# EasyEDA Pro project pcb文件.epro

# Schematic Schematic1
Board Name: Board1; Create Date: 2024-08-30; Page Name: P1; Project Name: New Project_2024-08-30_11-55-39; Schematic Name: Schematic1; Update Date: 2026-05-20; Add into BOM: yes; Company: 嘉立创EDA; Convert to PCB: yes; Page Size: A4; Version: V1.0
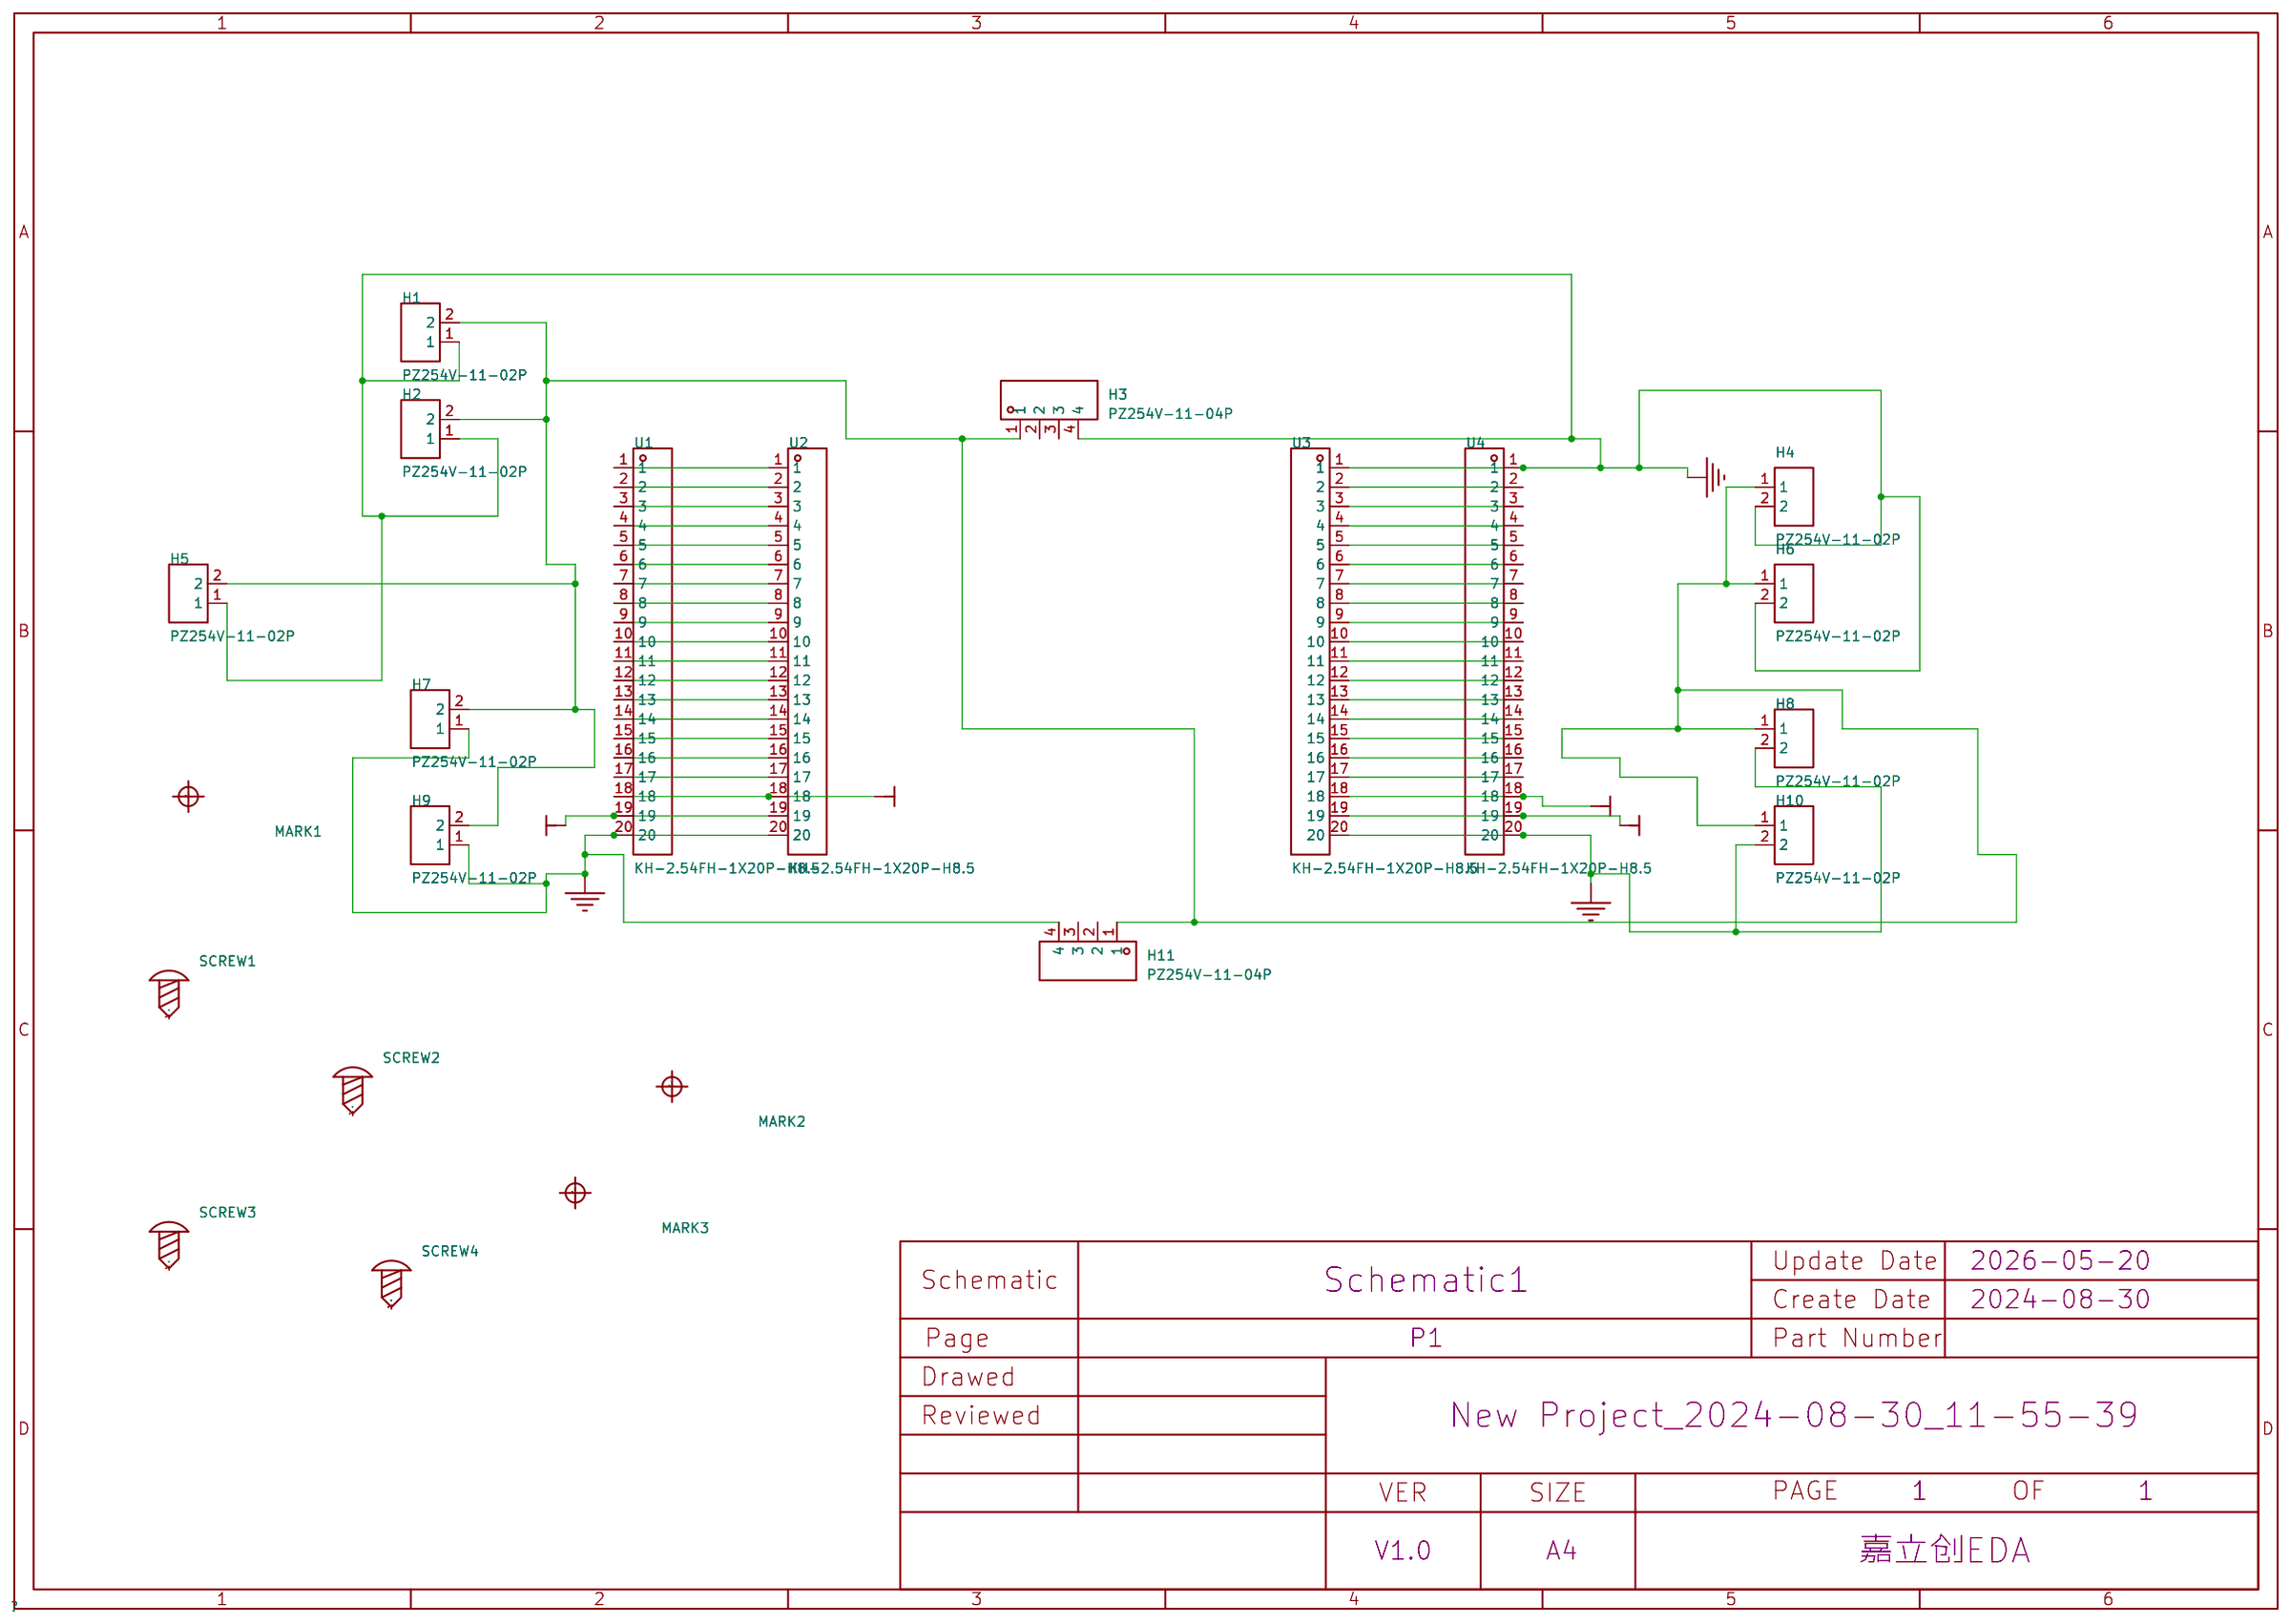
[diagram p0: schematic sheet]

## Parts
H1  PZ254V-11-02P  [HDR-TH_2P-P2.54-V-M]
H2  PZ254V-11-02P  [HDR-TH_2P-P2.54-V-M]
H3  PZ254V-11-04P  [HDR-TH_4P-P2.54-V-M]
H4  PZ254V-11-02P  [HDR-TH_2P-P2.54-V-M]
H5  PZ254V-11-02P  [HDR-TH_2P-P2.54-V-M]
H6  PZ254V-11-02P  [HDR-TH_2P-P2.54-V-M]
H7  PZ254V-11-02P  [HDR-TH_2P-P2.54-V-M]
H8  PZ254V-11-02P  [HDR-TH_2P-P2.54-V-M]
H9  PZ254V-11-02P  [HDR-TH_2P-P2.54-V-M]
H10  PZ254V-11-02P  [HDR-TH_2P-P2.54-V-M]
H11  PZ254V-11-04P  [HDR-TH_4P-P2.54-V-M]
MARK1  -  [Mark-Point-1mm]  (no BOM)
MARK2  -  [Mark-Point-1mm]  (no BOM)
MARK3  -  [Mark-Point-1mm]  (no BOM)
SCREW1  -  [M3螺丝]
SCREW2  -  [M3螺丝]
SCREW3  -  [M3螺丝]
SCREW4  -  [M3螺丝]
U1  KH-2.54FH-1X20P-H8.5  [HDR-TH_20P-P2.54-V-F-2]
U2  KH-2.54FH-1X20P-H8.5  [HDR-TH_20P-P2.54-V-F-2]
U3  KH-2.54FH-1X20P-H8.5  [HDR-TH_20P-P2.54-V-F-2]
U4  KH-2.54FH-1X20P-H8.5  [HDR-TH_20P-P2.54-V-F-2]

## Library data of the parts
H1 H2 H4-H10 = PZ254V-11-02P: 插针结构:1x2P;间距:2.54mm;行距:-;圆针/方针:方针;安装方式:直插;排数:单排;总PIN位数:2P;额定电流:3A;额定电压:250V;配合针长度:6mm;塑高:2.5mm;端接针长度:3mm;触头材质:黄铜;触头镀层:-;工作温度:-40℃~+105℃;颜色:黑色;; LCSC Part Name: 1x2P 间距:2.54mm 方针 直插; Supplier Part: C492401; Manufacturer: XFCN(兴飞); Supplier Footprint: 插件,P=2.54mm; JLCPCB Part Class: Extended Part; Datasheet: https://item.szlcsc.com/datasheet/PZ254V-11-02P/502957.html; Supplier: LCSC; Pin Structure: 1x2P; Pitch: 2.54mm; Circluar Pins/Square Pins: 方针; Mounting Type: 直插; Number of Rows: 单排; Number of Pins: 2P; Current Rating: 3A; Voltage Rating (Max): 250V; Length of Mating Pin: 6mm; Insulation Height: 2.5mm; Length of End Connection Pin: 3mm; Contact Material: 黄铜; Operating Temperature: -40℃~+105℃; Color: 黑色
H3 H11 = PZ254V-11-04P: 插针结构:1x4P;间距:2.54mm;行距:-;圆针/方针:方针;安装方式:直插;排数:单排;总PIN位数:4P;额定电流:3A;额定电压:250V;配合针长度:6mm;塑高:2.5mm;端接针长度:3mm;触头材质:-;工作温度:-40℃~+105℃;颜色:黑色;; LCSC Part Name: 1x4P 间距:2.54mm 方针 直插; Supplier Part: C2691448; Manufacturer: XFCN(兴飞); Supplier Footprint: 插件,P=2.54mm; JLCPCB Part Class: 扩展库; Datasheet: https://item.szlcsc.com/datasheet/PZ254V-11-04P/2801085.html; Supplier: LCSC; Pin Structure: 1x4P; Pitch: 2.54mm; Circluar Pins/Square Pins: 方针; Mounting Type: 直插; Number of Rows: 单排; Number of Pins: 4P; Current Rating: 3A; Voltage Rating (Max): 250V; Length of Mating Pin: 6mm; Insulation Height: 2.5mm; Length of End Connection Pin: 3mm; Operating Temperature: -40℃~+105℃; Color: 黑色
MARK1-MARK3 = Mark-Point: Mark点
SCREW1-SCREW4 = M3螺丝: Supplier Footprint: 插件
U1-U4 = KH-2.54FH-1X20P-H8.5: 插孔结构:1x20P;间距:2.54mm;行距:-;圆孔/方孔:方孔;安装方式:直插;排数:单排;总孔位数:20P;额定电流:3A;额定电压:-;插孔方向:顶部;塑高:8.5mm;工作温度:-40℃~+105℃;; LCSC Part Name: 间距:2.54mm 1x20P 直插; Supplier Part: C2905423; Manufacturer: kinghelm(金航标); Supplier Footprint: 插件,P=2.54mm; JLCPCB Part Class: 扩展库; Datasheet: https://item.szlcsc.com/datasheet/KH-2.54FH-1X20P-H8.5/3175197.html; Supplier: LCSC; Holes Structure: 1x20P; Pitch: 2.54mm; Circular Hole / Square Hole: 方孔; Mounting Type: 直插; Number of Rows: 单排; Number of Positions: 20P; Current Rating: 3A; Holes Direction: 顶部; Insulation Height: 8.5mm; Operating Temperature: -40℃~+105℃

## Nets
3.3V: U1.19 U2.19 U3.19 U4.19
5V: U1.18 U2.18 U3.18 U4.18
GND: H1.1 H2.1 H3.4 H4.2 H5.1 H6.2 H7.1 H8.2 H9.1 H10.2 H11.4 U1.20 U2.20 U3.1 U3.20 U4.1 U4.20
$1N2: U1.1 U2.1
$1N3: U1.2 U2.2
$1N4: U1.3 U2.3
$1N5: U1.4 U2.4
$1N6: U1.5 U2.5
$1N12: U3.2 U4.2
$1N13: U3.3 U4.3
$1N14: U3.4 U4.4
$1N15: U3.5 U4.5
$1N16: U3.6 U4.6
$1N17: U3.7 U4.7
$1N18: U3.8 U4.8
$1N19: U3.9 U4.9
$1N20: U3.10 U4.10
$1N21: U3.11 U4.11
$1N22: U3.12 U4.12
$1N23: U3.13 U4.13
$1N24: U3.14 U4.14
$1N25: U3.15 U4.15
$1N26: U3.16 U4.16
$1N27: U3.17 U4.17
$1N30: U1.6 U2.6
$1N31: U1.7 U2.7
$1N32: U1.8 U2.8
$1N33: U1.9 U2.9
$1N34: U1.10 U2.10
$1N35: U1.11 U2.11
$1N36: U1.12 U2.12
$1N37: U1.13 U2.13
$1N38: U1.14 U2.14
$1N39: U1.15 U2.15
$1N40: U1.16 U2.16
$1N41: U1.17 U2.17
$1N67: H1.2 H2.2 H3.1 H4.1 H5.2 H6.1 H7.2 H8.1 H9.2 H10.1 H11.1

Not connected (* = marked no-connect by the designer): H3 2 3; H11 2 3; MARK1 1; MARK2 1; MARK3 1; SCREW1 1; SCREW2 1; SCREW3 1; SCREW4 1

# Board PCB1
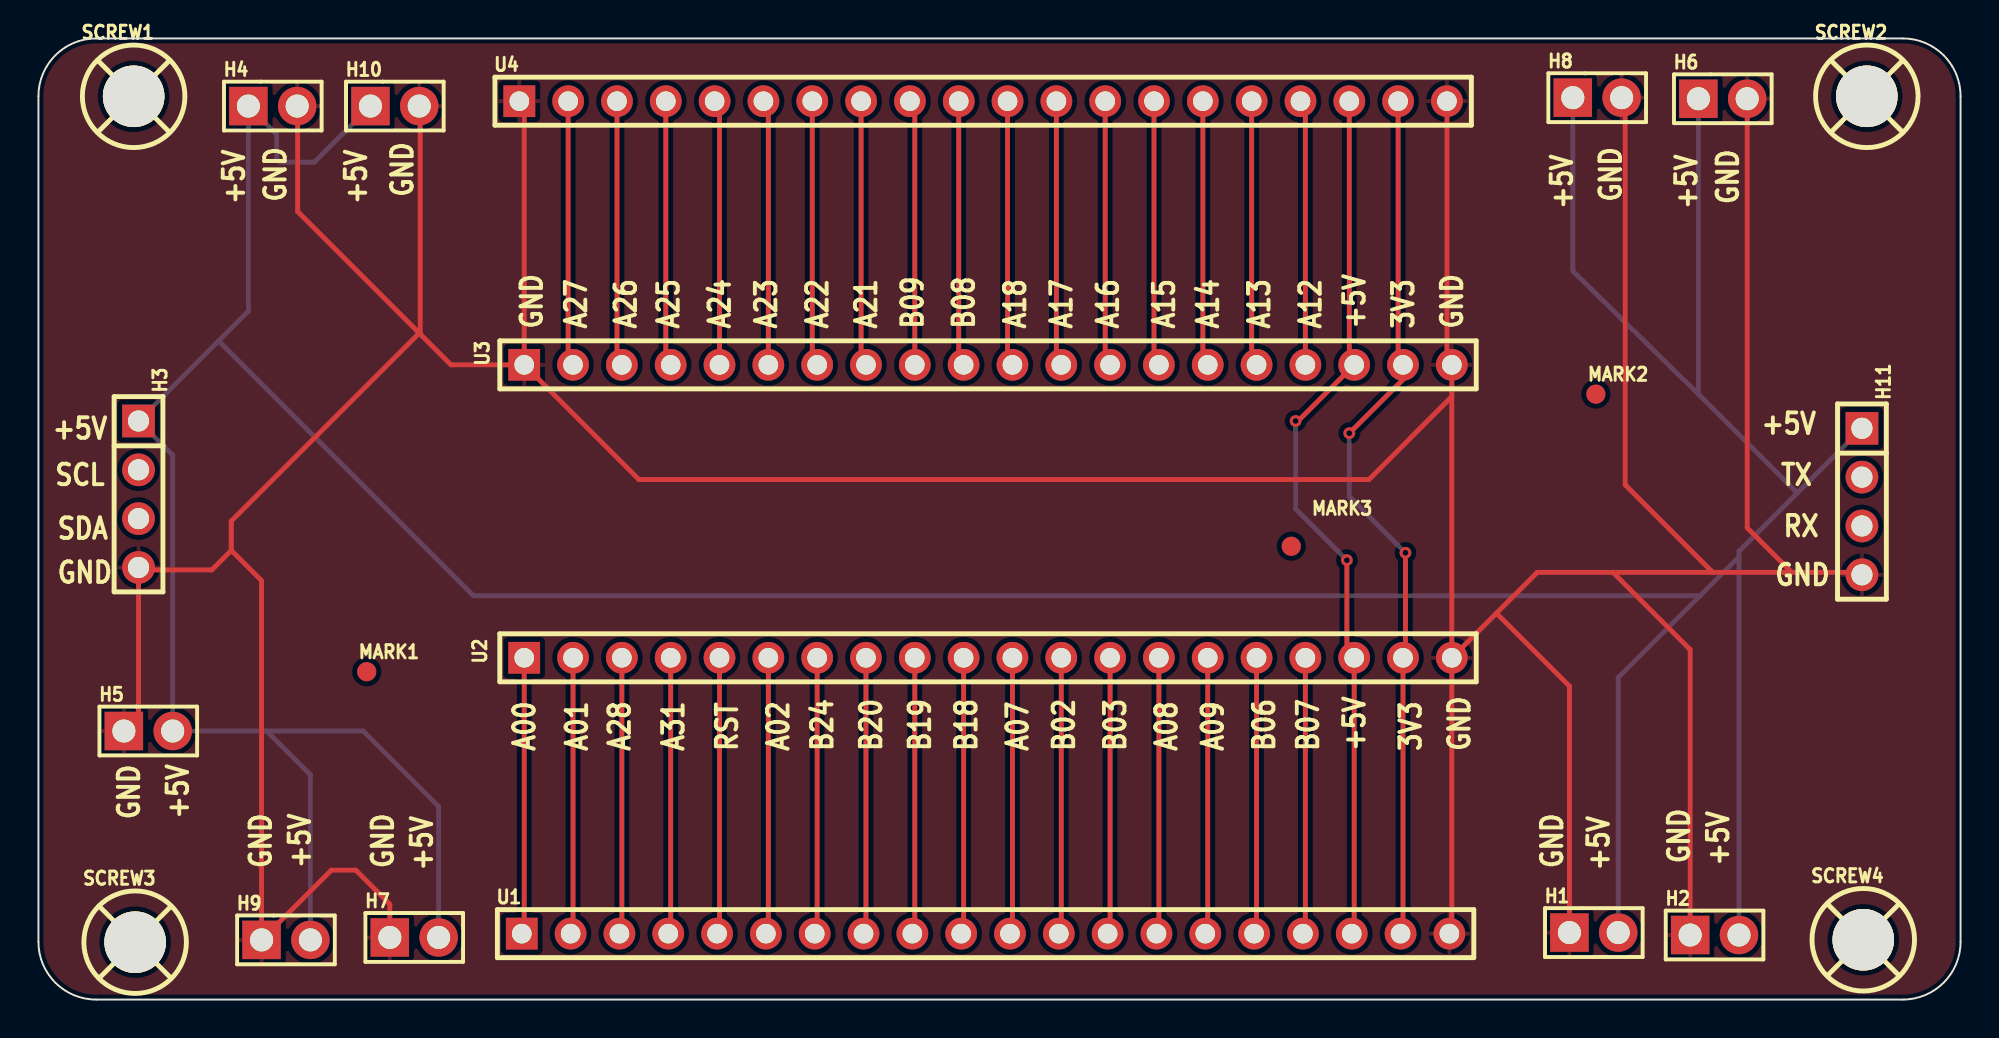
[diagram p1: board, top side]
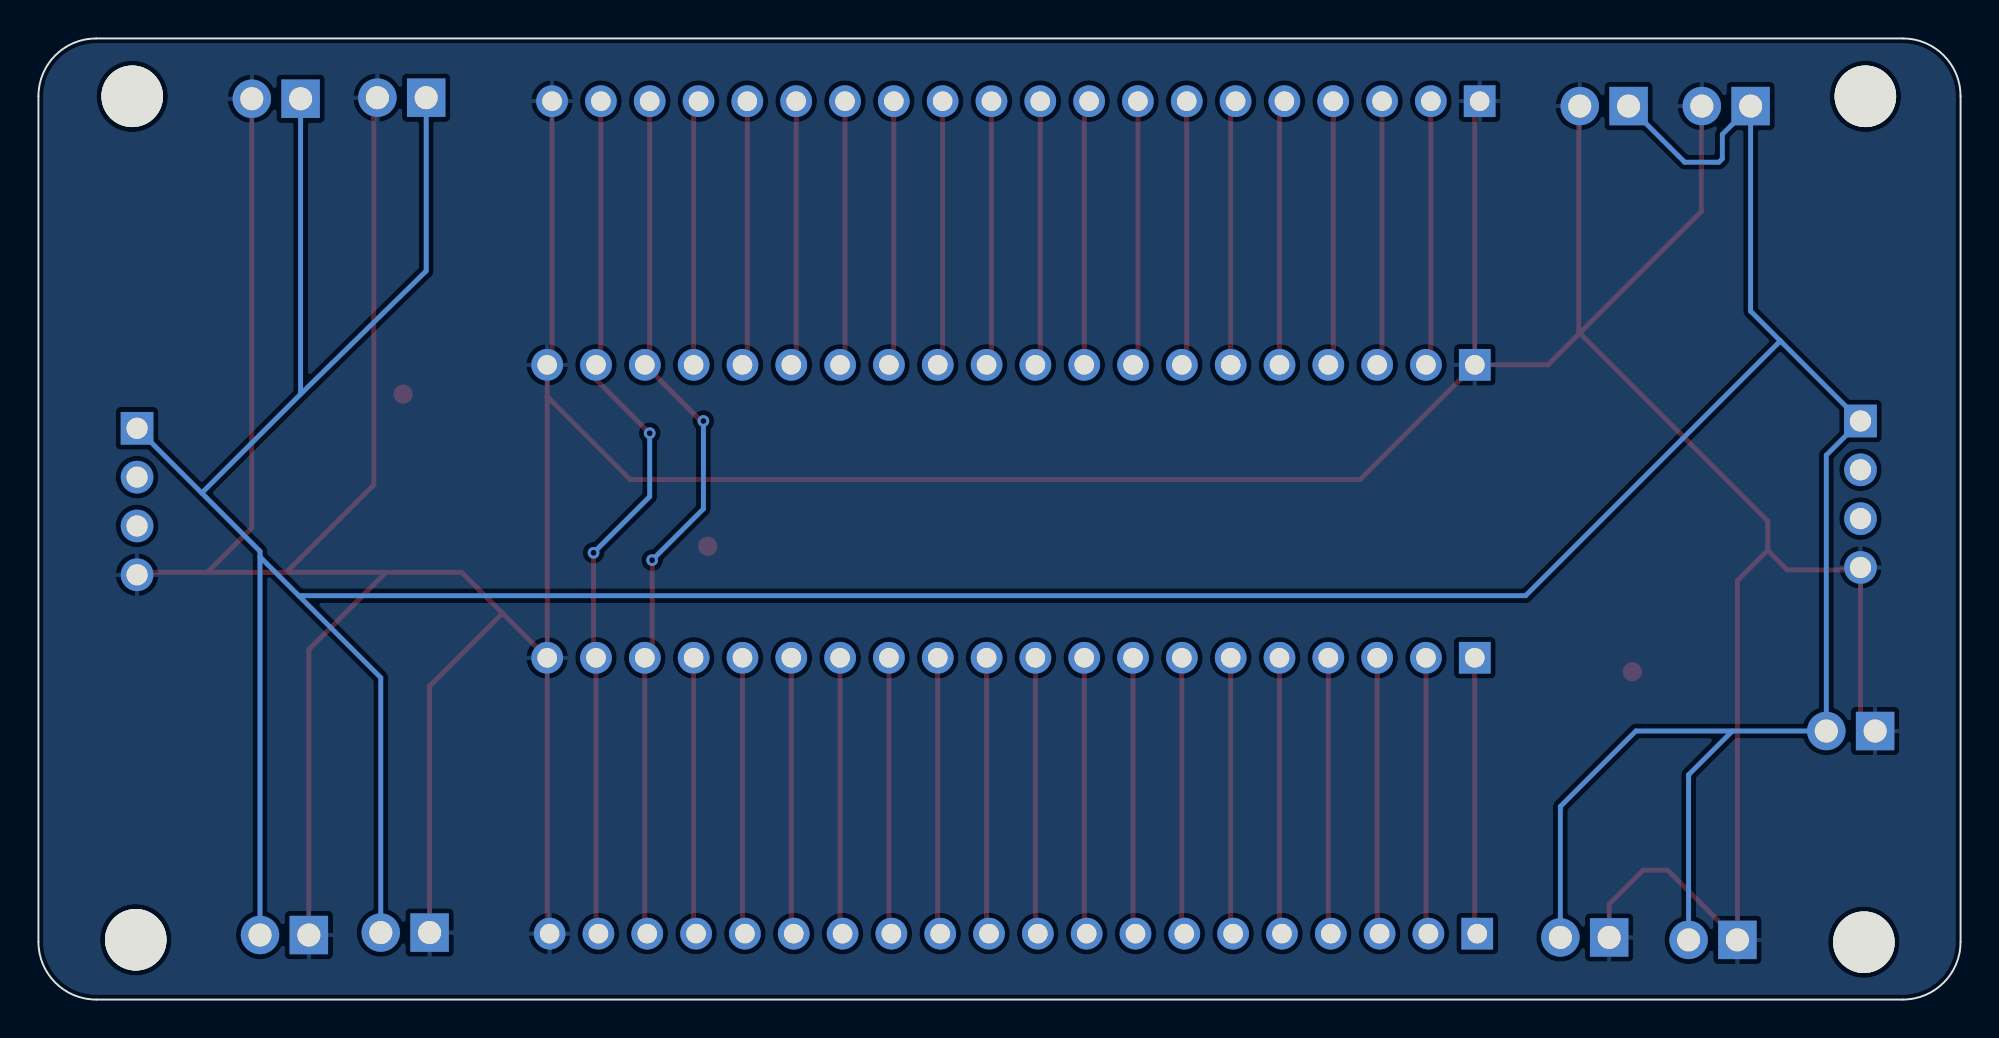
[diagram p2: board, bottom side, seen from below]

Outline 100 x 50 mm; copper layers: Top Layer, Bottom Layer. Coordinates in mm from the lower left corner of the outline.
Outline path: 0,47 0,3 arc(0.88,0.88) 3,0 97,0 arc(99.12,0.88) 100,3 100,47 arc(99.12,49.12) 97,50 3,50 arc(0.88,49.12) 0,47
Stack: Top Layer 0.035mm / Dielectric1 1.51mm FR4 er 4.5 / Bottom Layer 0.035mm

## Design rules (mm)
spacing copperThickness1oz (default): track to track 0.102, other pairs 0.152 to 0.3
spacing copperThickness2oz: track to track 0.203, other pairs 0.152 to 0.3
spacing Plane_innerPlane: track to track 0.102, other pairs 0.152 to 0.3
spacing Copper_copperRegion: track to track 0.102, other pairs 0.152 to 0.3
track width copperThickness1oz (default): min 0.127, default 0.254, max 2.54
track width copperThickness2oz: min 0.203, default 0.254, max 2.54
differential pair differentialPair (default): width min 0.127, default 0.254, max 2.54; gap min 0.152, default 0.152
net GND uses copperRegion

## Placement (name value [footprint] x y rotation side)
H1  PZ254V-11-02P  [HDR-TH_2P-P2.54-V-M]  80.92 3.48 0 top
H2  PZ254V-11-02P  [HDR-TH_2P-P2.54-V-M]  87.2 3.36 0 top
H3  PZ254V-11-04P  [HDR-TH_4P-P2.54-V-M]  5.21 26.29 270 top
H4  PZ254V-11-02P  [HDR-TH_2P-P2.54-V-M]  12.19 46.48 0 top
H5  PZ254V-11-02P  [HDR-TH_2P-P2.54-V-M]  5.72 13.97 0 top
H6  PZ254V-11-02P  [HDR-TH_2P-P2.54-V-M]  87.63 46.86 0 top
H7  PZ254V-11-02P  [HDR-TH_2P-P2.54-V-M]  19.55 3.23 0 top
H8  PZ254V-11-02P  [HDR-TH_2P-P2.54-V-M]  81.1 46.92 0 top
H9  PZ254V-11-02P  [HDR-TH_2P-P2.54-V-M]  12.88 3.1 0 top
H10  PZ254V-11-02P  [HDR-TH_2P-P2.54-V-M]  18.54 46.48 0 top
H11  PZ254V-11-04P  [HDR-TH_4P-P2.54-V-M]  94.87 25.91 270 top
MARK1  -  [Mark-Point-1mm]  17.08 17.06 0 top
MARK2  -  [Mark-Point-1mm]  81.03 31.5 0 top
MARK3  -  [Mark-Point-1mm]  65.18 23.58 0 top
SCREW1  -  [M3螺丝]  4.95 46.99 0 top
SCREW2  -  [M3螺丝]  95.12 46.99 0 top
SCREW3  -  [M3螺丝]  5.03 2.98 0 top
SCREW4  -  [M3螺丝]  94.94 3.11 0 top
U1  KH-2.54FH-1X20P-H8.5  [HDR-TH_20P-P2.54-V-F-2]  49.28 3.43 0 top
U2  KH-2.54FH-1X20P-H8.5  [HDR-TH_20P-P2.54-V-F-2]  49.4 17.78 0 top
U3  KH-2.54FH-1X20P-H8.5  [HDR-TH_20P-P2.54-V-F-2]  49.4 33.02 0 top
U4  KH-2.54FH-1X20P-H8.5  [HDR-TH_20P-P2.54-V-F-2]  49.15 46.74 0 top

## Footprints (pads in the part's own frame, mm; a bottom-side part is the same pattern mirrored in y, then rotated)
HDR-TH_2P-P2.54-V-M
  rect 2x2 hole 1.2: 1(-1.27,0)
  round 2 hole 1.2: 2(1.27,0)
HDR-TH_4P-P2.54-V-M
  rect 1.7x1.7 hole 1.1: 1(-3.81,0)
  round 1.7 hole 1.1: 2(-1.27,0) 3(1.27,0) 4(3.81,0)
HDR-TH_20P-P2.54-V-F-2
  rect 1.65x1.65 hole 1.02: 1(-24.13,0)
  round 1.65 hole 1.02: 2(-21.59,0) 3(-19.05,0) 4(-16.51,0) 5(-13.97,0) 6(-11.43,0) 7(-8.89,0) 8(-6.35,0) 9(-3.81,0) 10(-1.27,0) 11(1.27,0) 12(3.81,0) 13(6.35,0) 14(8.89,0) 15(11.43,0) 16(13.97,0) 17(16.51,0) 18(19.05,0) 19(21.59,0) 20(24.13,0)
M3螺丝
  round 3.2 hole 3.2: 1(0,0)
Mark-Point-1mm
  round 1 smd: 1(0,0)

## Nets
As in the schematic.

Pads without a net: H3 2 3; H11 2 3; MARK1 1; MARK2 1; MARK3 1; SCREW1 1; SCREW2 1; SCREW3 1; SCREW4 1

## Via types
v1: diameter 0.61, hole 0.305, Top Layer to Bottom Layer, 4 vias

## Routing (per net, layer and track width the routed paths; a pad name or vN(x,y) marks a point on that pad's centre or on a via; arc(x,y) is an arc through that point)
3.3V: length 45.9
  Top Layer w0.254: U4.19 70.74,33.27 U3.19 70.99,32.26 v1(68.2,29.46) ; v1(71.12,23.24) 71.12,17.91 U2.19 70.99,3.56 U1.19
  Bottom Layer w0.254: v1(71.12,23.24) 68.2,26.16 v1(68.2,29.46)
5V: length 46.1
  Top Layer w0.254: v1(68.07,22.86) 68.07,18.16 U2.18 68.45,3.56 U1.18 ; v1(65.4,30.1) 65.53,30.1 U3.18 68.2,33.27 U4.18
  Bottom Layer w0.254: v1(68.07,22.86) 65.4,25.53 v1(65.4,30.1)
GND: length 317.4
  Top Layer w0.254: 10.03,23.37 11.61,21.79 H9.1 15.24,6.73 16.51,6.73 18.28,4.96 H7.1 ; 10.03,23.37 10.03,24.89 19.81,34.67 ; 10.03,23.37 9.02,22.35 5.33,22.35 ; 87.11,22.23 82.55,26.78 82.55,46.74 H8.2 ; 87.11,22.23 91.22,22.23 ; 87.11,22.23 81.92,22.23 ; U3.1 21.46,33.02 19.81,34.67 ; U3.1 31.24,27.05 69.21,27.05 73.53,31.37 ; U3.1 25.27,46.48 U4.1 ; U2.20 73.53,3.56 U1.20 ; U2.20 75.85,20.1 ; U2.20 73.53,31.37 ; 91.22,22.23 88.9,24.54 H6.2 ; 91.22,22.23 95,22.23 ; U4.20 73.28,33.27 U3.20 73.53,31.37 ; 19.81,34.67 13.49,41 13.49,46.46 H4.2 ; 19.81,34.67 19.86,34.72 19.86,46.43 H10.2 ; 81.92,22.23 85.93,18.21 H2.1 ; 81.92,22.23 77.98,22.23 75.85,20.1 ; H3.4 5.21,14.73 H5.1 ; 75.85,20.1 79.65,16.31 H1.1
$1N2: length 14.4
  Top Layer w0.254: U2.1 25.27,3.56 U1.1
$1N3: length 14.4
  Top Layer w0.254: U1.2 27.81,3.56 U2.2
$1N4: length 14.4
  Top Layer w0.254: U2.3 30.35,3.56 U1.3
$1N5: length 14.4
  Top Layer w0.254: U1.4 32.89,3.56 32.89,17.78
$1N6: length 14.4
  Top Layer w0.254: U1.5 35.43,3.56 U2.5
$1N12: length 13.8
  Top Layer w0.254: U4.2 27.56,33.27 U3.2
$1N13: length 13.8
  Top Layer w0.254: U3.3 30.1,33.27 U4.3
$1N14: length 13.8
  Top Layer w0.254: 32.89,33.02 32.64,33.27 U4.4
$1N15: length 13.8
  Top Layer w0.254: U3.5 35.43,46.48 U4.5
$1N16: length 13.8
  Top Layer w0.254: U4.6 37.97,46.48 U3.6
$1N17: length 13.8
  Top Layer w0.254: U4.7 40.26,33.27 U3.7
$1N18: length 13.8
  Top Layer w0.254: U3.8 42.8,33.27 U4.8
$1N19: length 13.8
  Top Layer w0.254: U4.9 45.59,46.48 U3.9
$1N20: length 13.8
  Top Layer w0.254: U3.10 47.88,33.27 U4.10
$1N21: length 13.8
  Top Layer w0.254: U4.11 50.42,33.27 U3.11
$1N22: length 13.8
  Top Layer w0.254: U3.12 52.96,33.27 U4.12
$1N23: length 13.8
  Top Layer w0.254: U3.13 55.5,33.27 U4.13
$1N24: length 13.8
  Top Layer w0.254: U4.14 58.04,33.27 U3.14
$1N25: length 13.8
  Top Layer w0.254: U3.15 60.58,33.27 U4.15
$1N26: length 13.8
  Top Layer w0.254: U3.16 63.12,33.27 U4.16
$1N27: length 13.8
  Top Layer w0.254: U3.17 65.91,46.48 U4.17
$1N30: length 14.4
  Top Layer w0.254: U2.6 37.97,3.56 U1.6
$1N31: length 14.4
  Top Layer w0.254: U2.7 40.51,3.56 U1.7
$1N32: length 14.4
  Top Layer w0.254: U1.8 43.05,3.56 U2.8
$1N33: length 14.4
  Top Layer w0.254: U1.9 45.59,3.56 U2.9
$1N34: length 14.4
  Top Layer w0.254: U1.10 48.13,3.56 U2.10
$1N35: length 14.4
  Top Layer w0.254: U1.11 50.67,3.56 U2.11
$1N36: length 14.4
  Top Layer w0.254: U1.12 53.21,3.56 U2.12
$1N37: length 14.4
  Top Layer w0.254: U1.13 55.75,3.56 U2.13
$1N38: length 14.4
  Top Layer w0.254: U2.14 58.29,3.56 U1.14
$1N39: length 14.4
  Top Layer w0.254: U2.15 60.83,3.56 U1.15
$1N40: length 14.4
  Top Layer w0.254: U1.16 63.37,3.56 U2.16
$1N41: length 14.4
  Top Layer w0.254: U2.17 65.91,3.56 U1.17
$1N67: length 253.7
  Bottom Layer w0.254: 11.87,13.97 H5.2 6.98,28.32 H3.1 9.37,34.26 ; 11.87,13.97 14.15,11.69 H9.2 ; 11.87,13.97 16.89,13.97 20.82,10.04 H7.2 ; H2.2 88.47,23.03 ; 88.47,23.03 88.47,23.32 91.5,26.35 ; 88.47,23.03 86.45,21.01 ; 86.45,21.01 82.19,16.75 H1.2 ; 86.45,21.01 22.63,21.01 9.37,34.26 ; 86.36,31.5 79.83,37.9 H8.1 ; 86.36,31.5 91.5,26.35 ; 86.36,31.5 H6.1 ; 9.37,34.26 10.92,35.81 H4.1 12.39,45.01 12.39,43.74 12.57,43.56 14.35,43.56 H10.1 ; 91.5,26.35 H11.1

## Copper pours and planes (outline as drawn; the poured copper is in the pictures)
GND on Top Layer: -0.64,51.69 103,51.69 103,-1.27 -0.64,-1.27
GND on Bottom Layer: -2.41,51.82 104.9,51.82 104.9,-2.29 -2.41,-2.29
GND on Bottom Layer: -3.17,53.59 107.32,53.59 107.32,-3.3 -3.17,-3.3

## Text on the board
Top Silkscreen Layer: +5V | SCL | SDA | GND | TX | RX | A00 | A27 | A01 | A28 | A26 | A25 | A31 | A24 | RST | A23 | A02 | A22 | B24 | A21 | B20 | B09 | B19 | B08 | B18 | A18 | A07 | A17 | B02 | A16 | B03 | A15 | A08 | A14 | A09 | A13 | B06 | B07 | A12 | 3V3
